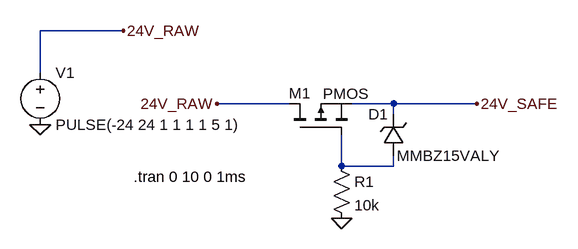
[diagram p0: schematic ReversePolarity.asc]
ReversePolarity.asc, the LTspice schematic file:
Version 4
SHEET 1 880 680
WIRE -160 32 -288 32
WIRE -288 96 -288 32
WIRE 96 144 -16 144
WIRE 256 144 192 144
WIRE 384 144 256 144
WIRE 256 160 256 144
WIRE 176 240 176 192
WIRE 256 240 256 224
WIRE 256 240 176 240
FLAG -16 144 24V_RAW
FLAG 384 144 24V_SAFE
FLAG 176 320 0
FLAG -288 176 0
FLAG -160 32 24V_RAW
SYMBOL pmos 96 192 R270
WINDOW 0 64 -1 VRight 2
WINDOW 3 63 51 VRight 2
SYMATTR InstName M1
SYMBOL zener 272 224 R180
WINDOW 0 24 64 Left 2
WINDOW 3 -148 0 Left 2
SYMATTR InstName D1
SYMATTR Value MMBZ15VALY
SYMBOL res 160 224 R0
SYMATTR InstName R1
SYMATTR Value 10k
SYMBOL voltage -288 80 R0
WINDOW 123 0 0 Left 0
WINDOW 39 0 0 Left 0
SYMATTR InstName V1
SYMATTR Value PULSE(-24 24 1 1 1 1 5 1)
TEXT -144 256 Left 2 !.tran 0 10 0 1ms

The netlist it stands for:
* ReversePolarity.asc
M1 24V_RAW N001 24V_SAFE 24V_SAFE PMOS
D1 N001 24V_SAFE MMBZ15VALY
R1 N001 0 10k
V1 24V_RAW 0 PULSE(-24 24 1 1 1 1 5 1)
.model D D
.lib standard.dio
.model NMOS NMOS
.model PMOS PMOS
.lib standard.mos
.tran 0 10 0 1ms
.backanno
.end